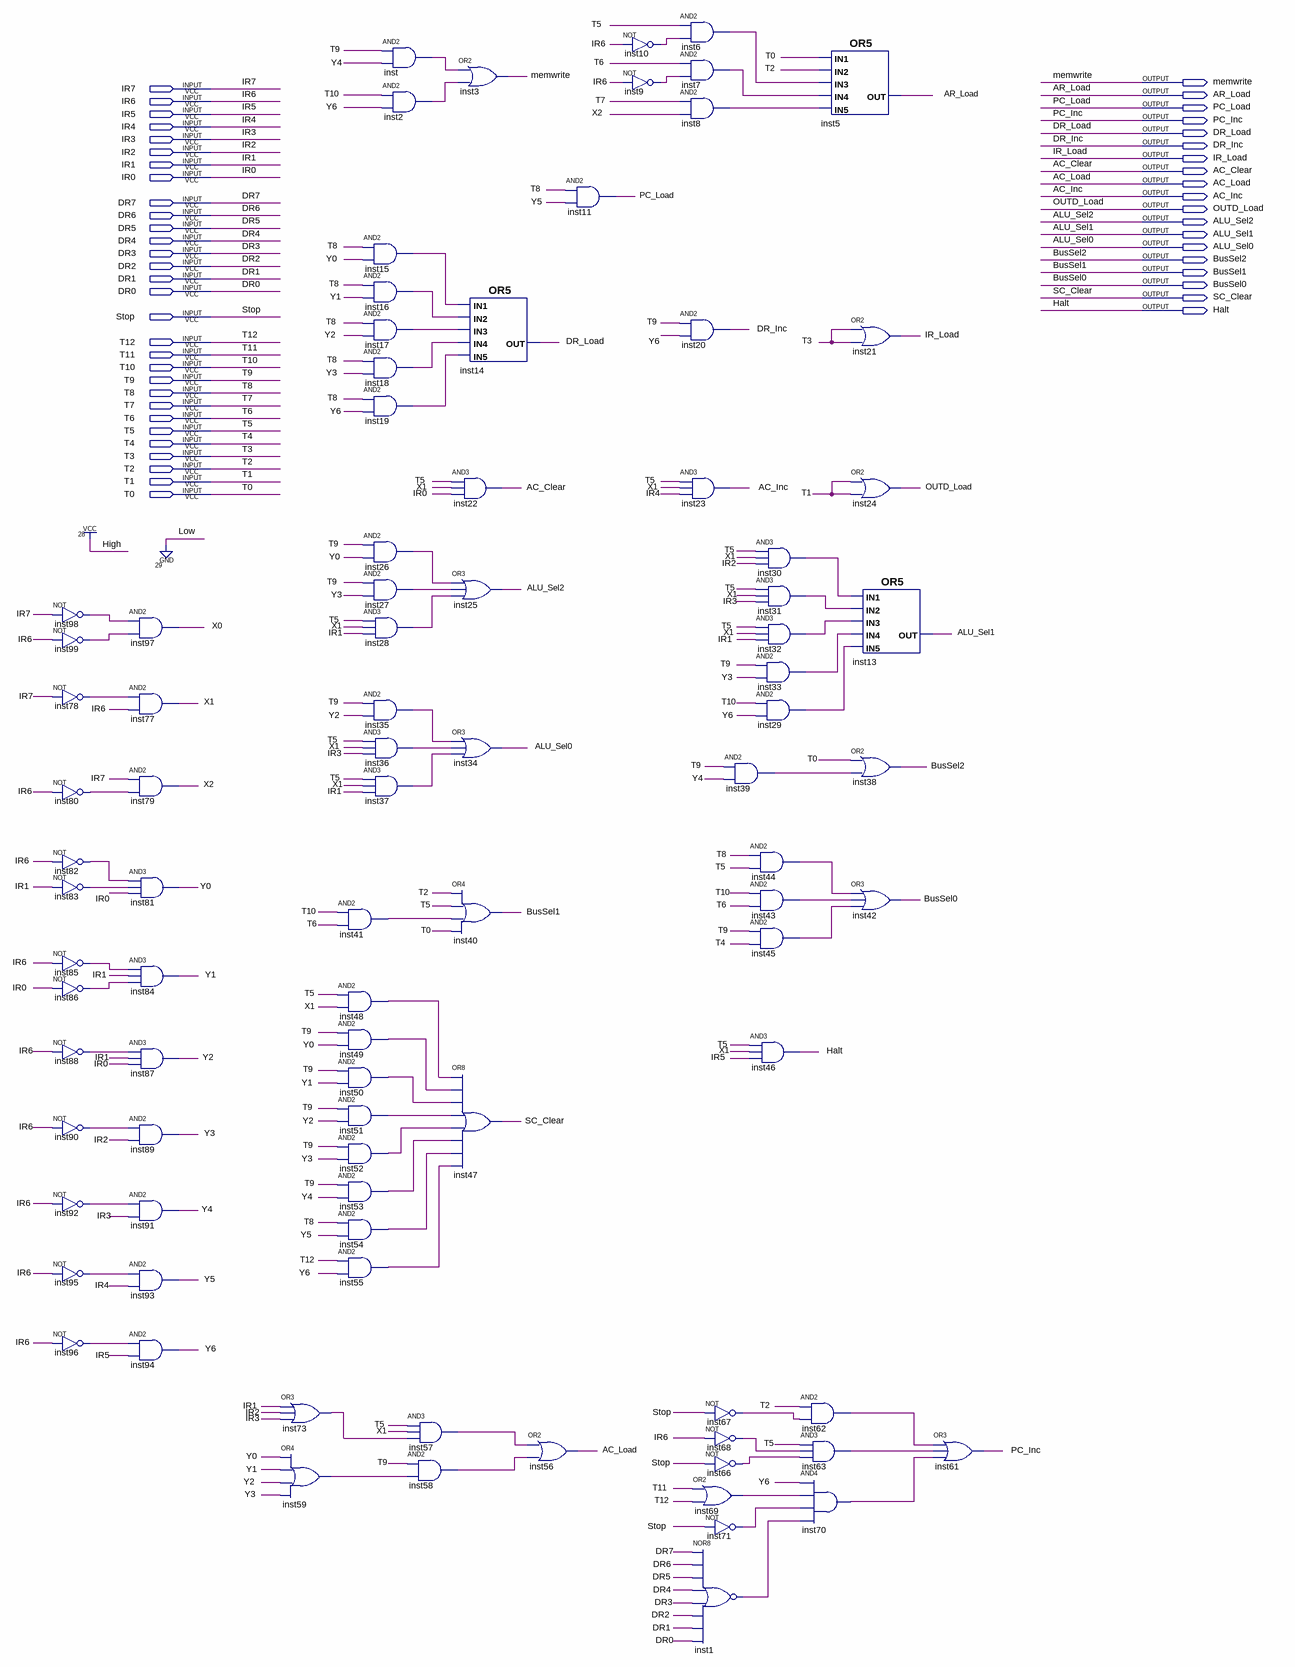
[diagram p0: schematic sheet]
// Quartus schematic lab3controller.bdf as structural Verilog: 91 symbols, 49 pins
module lab3controller (
  input  IR7,
  input  IR6,
  input  IR5,
  input  IR4,
  input  IR3,
  input  IR2,
  input  IR1,
  input  IR0,
  input  DR7,
  input  DR6,
  input  DR5,
  input  DR4,
  input  DR3,
  input  DR2,
  input  DR1,
  input  DR0,
  input  Stop,
  input  T12,
  input  T11,
  input  T10,
  input  T9,
  input  T8,
  input  T7,
  input  T6,
  input  T5,
  input  T4,
  input  T3,
  input  T2,
  input  T1,
  input  T0,
  output memwrite,
  output AR_Load,
  output PC_Load,
  output PC_Inc,
  output DR_Load,
  output DR_Inc,
  output IR_Load,
  output AC_Clear,
  output AC_Load,
  output AC_Inc,
  output OUTD_Load,
  output ALU_Sel2,
  output ALU_Sel1,
  output ALU_Sel0,
  output BusSel2,
  output BusSel1,
  output BusSel0,
  output SC_Clear,
  output Halt
);

  wire inst1_out, inst2_out, inst6_out, inst7_out, inst8_out, inst9_out, inst10_out, inst15_out, inst16_out,
       inst17_out, inst18_out, inst19_out, inst26_out, inst27_out, inst28_out, inst29_out, inst30_out,
       inst31_out, inst32_out, inst33_out, inst35_out, inst36_out, inst37_out, inst39_out, inst41_out,
       inst43_out, inst44_out, inst45_out, inst48_out, inst49_out, inst50_out, inst51_out, inst52_out,
       inst53_out, inst54_out, inst55_out, inst57_out, inst58_out, inst59_out, inst62_out, inst63_out,
       inst66_out, inst67_out, inst68_out, inst69_out, inst70_out, inst71_out, inst73_out, inst78_out,
       inst80_out, inst82_out, inst83_out, inst85_out, inst86_out, inst88_out, inst90_out, inst92_out,
       inst95_out, inst96_out, inst98_out, inst99_out, inst_out, X0, X1, X2, Y0, Y1, Y2, Y3, Y4, Y5, Y6;

  not inst98 (inst98_out, IR7);
  not inst99 (inst99_out, IR6);
  not inst78 (inst78_out, IR7);
  not inst80 (inst80_out, IR6);
  not inst82 (inst82_out, IR6);
  not inst83 (inst83_out, IR1);
  not inst85 (inst85_out, IR6);
  not inst86 (inst86_out, IR0);
  not inst88 (inst88_out, IR6);
  not inst90 (inst90_out, IR6);
  not inst92 (inst92_out, IR6);
  not inst95 (inst95_out, IR6);
  not inst96 (inst96_out, IR6);
  and inst97 (X0, inst98_out, inst99_out);
  and inst77 (X1, inst78_out, IR6);
  and inst79 (X2, IR7, inst80_out);
  and inst81 (Y0, inst82_out, inst83_out, IR0);
  and inst84 (Y1, inst85_out, IR1, inst86_out);
  and inst87 (Y2, inst88_out, IR1, IR0);
  and inst89 (Y3, inst90_out, IR2);
  and inst91 (Y4, inst92_out, IR3);
  and inst93 (Y5, inst95_out, IR4);
  and inst94 (Y6, inst96_out, IR5);
  or inst73 (inst73_out, IR1, IR2, IR3);
  or inst59 (inst59_out, Y0, Y1, Y2, Y3);
  and inst41 (inst41_out, T10, T6);
  and inst48 (inst48_out, T5, X1);
  and inst49 (inst49_out, T9, Y0);
  and inst50 (inst50_out, T9, Y1);
  and inst51 (inst51_out, T9, Y2);
  and inst52 (inst52_out, T9, Y3);
  and inst53 (inst53_out, T9, Y4);
  and inst54 (inst54_out, T8, Y5);
  and inst55 (inst55_out, T12, Y6);
  and inst (inst_out, T9, Y4);
  and inst2 (inst2_out, T10, Y6);
  and inst15 (inst15_out, T8, Y0);
  and inst16 (inst16_out, T8, Y1);
  and inst17 (inst17_out, T8, Y2);
  and inst18 (inst18_out, T8, Y3);
  and inst19 (inst19_out, T8, Y6);
  and inst26 (inst26_out, T9, Y0);
  and inst27 (inst27_out, T9, Y3);
  and inst28 (inst28_out, T5, X1, IR1);
  and inst35 (inst35_out, T9, Y2);
  and inst36 (inst36_out, T5, X1, IR3);
  and inst37 (inst37_out, T5, X1, IR1);
  and inst22 (AC_Clear, T5, X1, IR0);
  or inst25 (ALU_Sel2, inst26_out, inst27_out, inst28_out);
  or inst34 (ALU_Sel0, inst35_out, inst36_out, inst37_out);
  or inst40 (BusSel1, T2, T5, inst41_out, T0);
  or inst47 (SC_Clear, inst48_out, inst49_out, inst50_out, inst51_out, inst52_out, inst53_out, inst54_out, inst55_out);
  and inst57 (inst57_out, T5, X1, inst73_out);
  and inst58 (inst58_out, T9, inst59_out);
  or inst3 (memwrite, inst_out, inst2_out);
  or inst14 (DR_Load, inst15_out, inst16_out, inst17_out, inst18_out, inst19_out);
  or inst56 (AC_Load, inst57_out, inst58_out);
  and inst11 (PC_Load, T8, Y5);
  not inst10 (inst10_out, IR6);
  not inst9 (inst9_out, IR6);
  and inst6 (inst6_out, T5, inst10_out);
  and inst7 (inst7_out, T6, inst9_out);
  and inst8 (inst8_out, T7, X2);
  and inst20 (DR_Inc, T9, Y6);
  and inst23 (AC_Inc, T5, X1, IR4);
  not inst67 (inst67_out, Stop);
  not inst68 (inst68_out, IR6);
  not inst66 (inst66_out, Stop);
  or inst69 (inst69_out, T11, T12);
  not inst71 (inst71_out, Stop);
  nor inst1 (inst1_out, DR7, DR6, DR5, DR4, DR3, DR2, DR1, DR0);
  and inst30 (inst30_out, T5, X1, IR2);
  and inst31 (inst31_out, T5, X1, IR3);
  and inst32 (inst32_out, T5, X1, IR1);
  and inst33 (inst33_out, T9, Y3);
  and inst29 (inst29_out, T10, Y6);
  and inst39 (inst39_out, T9, Y4);
  and inst44 (inst44_out, T8, T5);
  and inst43 (inst43_out, T10, T6);
  and inst45 (inst45_out, T9, T4);
  and inst46 (Halt, T5, X1, IR5);
  and inst62 (inst62_out, T2, inst67_out);
  and inst63 (inst63_out, T5, inst68_out, inst66_out);
  and inst70 (inst70_out, Y6, inst69_out, inst71_out, inst1_out);
  or inst5 (AR_Load, T0, T2, inst6_out, inst7_out, inst8_out);
  or inst21 (IR_Load, T3, T3);
  or inst24 (OUTD_Load, T1, T1);
  or inst13 (ALU_Sel1, inst30_out, inst31_out, inst32_out, inst33_out, inst29_out);
  or inst38 (BusSel2, T0, inst39_out);
  or inst42 (BusSel0, inst44_out, inst43_out, inst45_out);
  or inst61 (PC_Inc, inst62_out, inst63_out, inst70_out);
endmodule
